# EAGLE design Teensy_FrequencyShield (EAGLE 6.6.0)
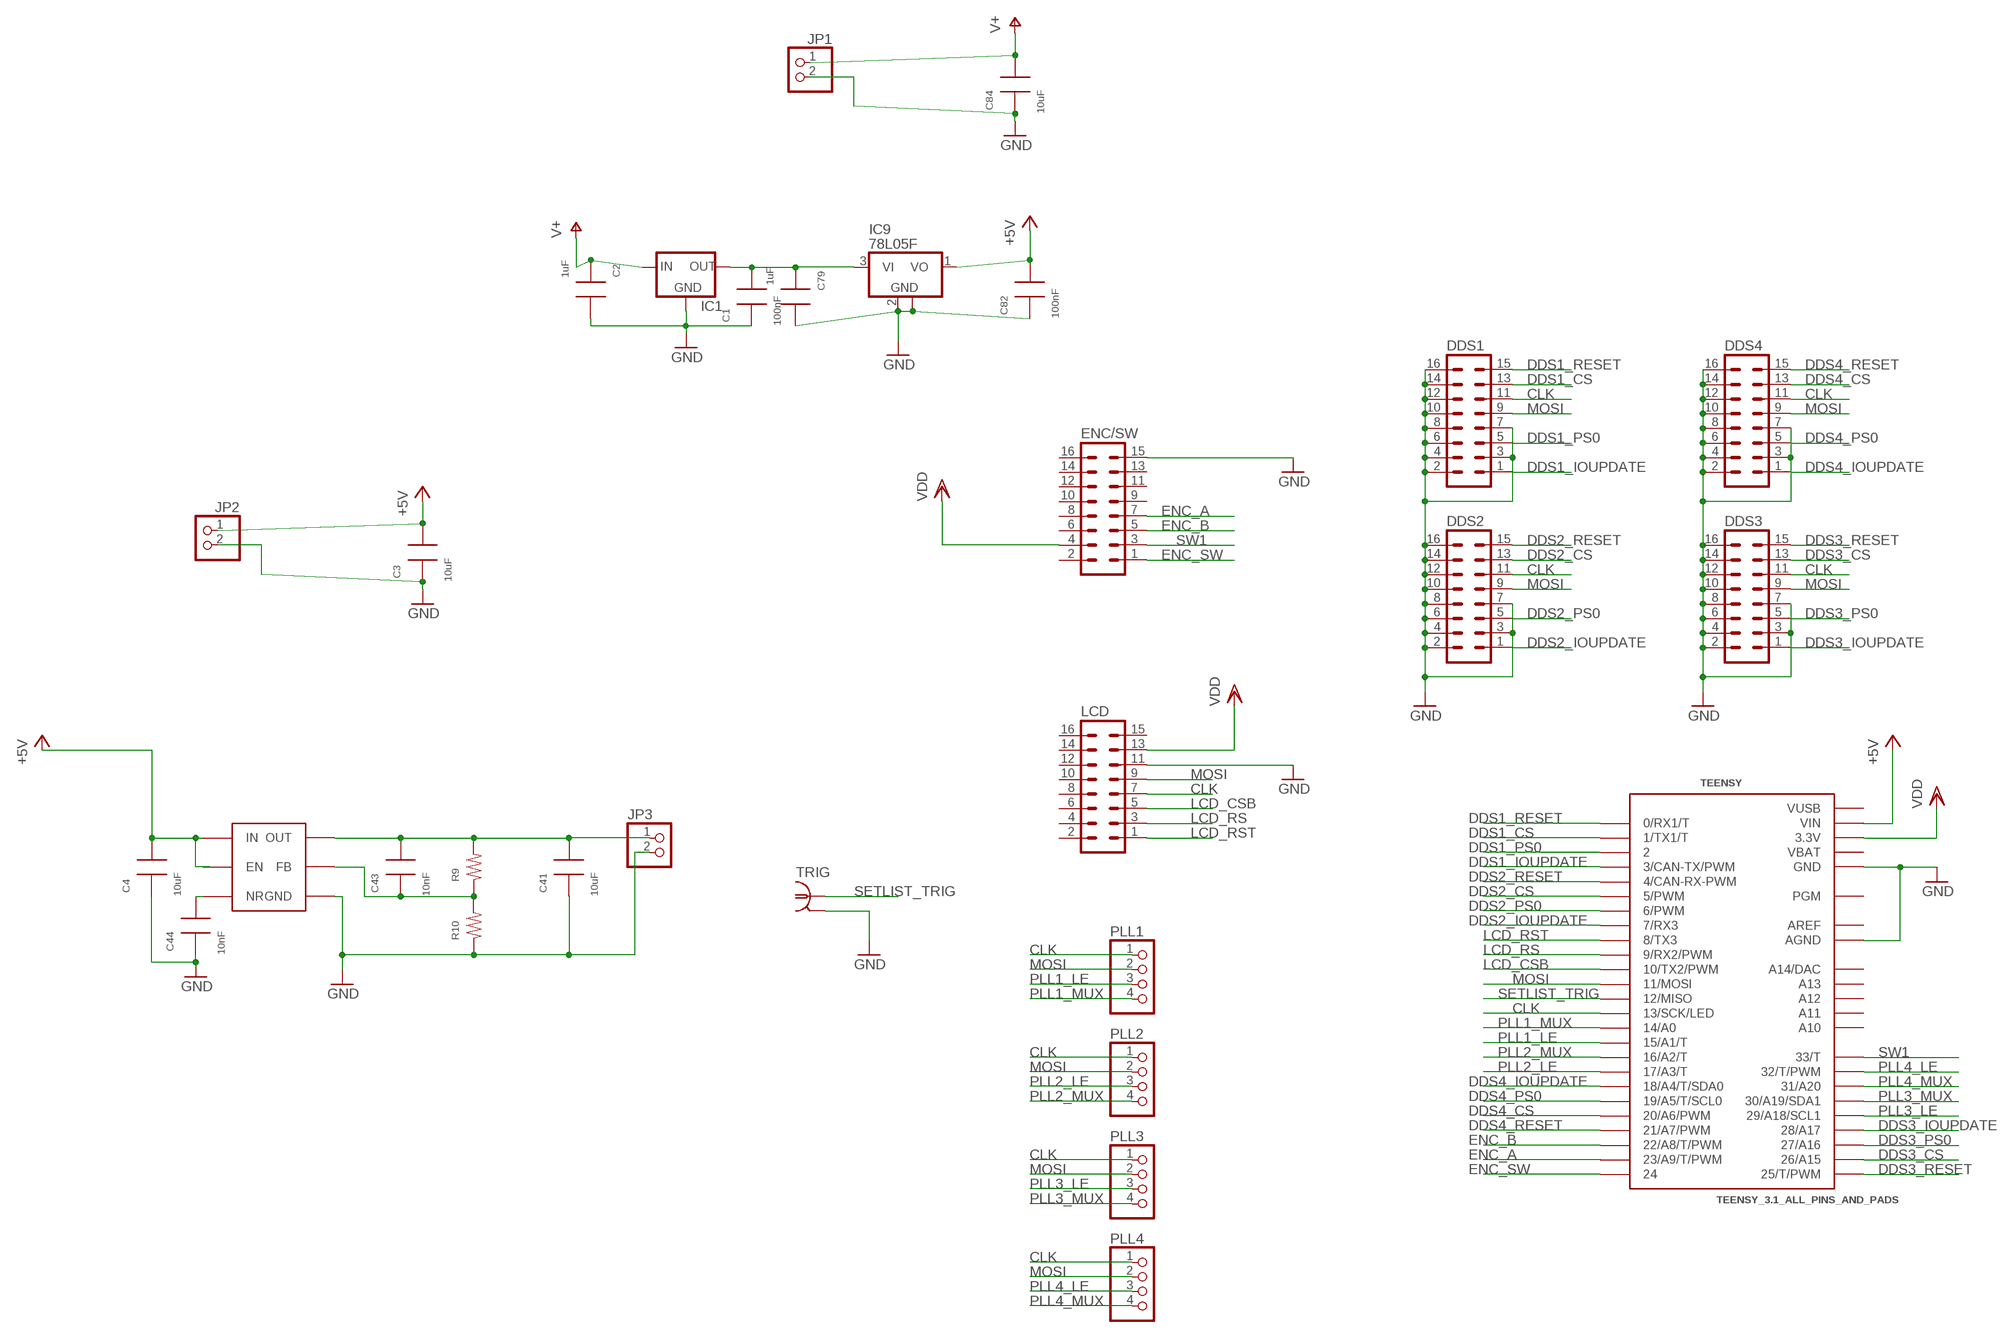
[diagram p0: schematic, sheet 1]

## Parts
C1  100nF  CAP0603  [0603]
C2  1uF  CAP0805  [0805]
C3  10uF  CAP0805  [0805]
C4  10uF  CAP0805  [0805]
C41  10uF  CAP0805  [0805]
C43  10nF  CAP0603  [0603]
C44  10nF  CAP0603  [0603]
C79  1uF  CAP0805  [0805]
C82  100nF  CAP0603  [0603]
C84  10uF  CAP0805  [0805]
DDS1  ML16  [ML16]
DDS2  ML16  [ML16]
DDS3  ML16  [ML16]
DDS4  ML16  [ML16]
ENC/SW  ML16  [ML16]
IC1  78XX-TO220  [TO220]
IC9  78L05F  [SOT89]
JP1  PINHD-1X2  [1X02]
JP2  PINHD-1X2  [1X02]
JP3  PINHD-1X2  [1X02]
LCD  ML16  [ML16]
PLL1  PINHD-1X4  [1X04]
PLL2  PINHD-1X4  [1X04]
PLL3  PINHD-1X4  [1X04]
PLL4  PINHD-1X4  [1X04]
R9  RES0603  [0603]
R10  RES0603  [0603]
TEENSY  TEENSY_3.1_ALL_PINS_AND_PADS  [TEENSY_3.1_ALLPINS]
TRIG  BNC-H  [BNC90]
U4  TPS7A4901  TPS7A49XX  [DGN]

## Nets
+5V: C3.2 C4.2 C82.2 IC9.1(VO) JP2.1 TEENSY.VIN U4.IN
CLK: DDS1.11 DDS2.11 DDS3.11 DDS4.11 LCD.7 PLL1.1 PLL2.1 PLL3.1 PLL4.1 TEENSY.13(13/SCK/LED)
DDS1_CS: DDS1.13 TEENSY.1(1/TX1/T)
DDS1_IOUPDATE: DDS1.1 TEENSY.3(3/CAN-TX/PWM)
DDS1_PS0: DDS1.5 TEENSY.2
DDS1_RESET: DDS1.15 TEENSY.0(0/RX1/T)
DDS2_CS: DDS2.13 TEENSY.5(5/PWM)
DDS2_IOUPDATE: DDS2.1 TEENSY.7(7/RX3)
DDS2_PS0: DDS2.5 TEENSY.6(6/PWM)
DDS2_RESET: DDS2.15 TEENSY.4(4/CAN-RX-PWM)
DDS3_CS: DDS3.13 TEENSY.26(26/A15)
DDS3_IOUPDATE: DDS3.1 TEENSY.28(28/A17)
DDS3_PS0: DDS3.5 TEENSY.27(27/A16)
DDS3_RESET: DDS3.15 TEENSY.25(25/T/PWM)
DDS4_CS: DDS4.13 TEENSY.20/A6(20/A6/PWM)
DDS4_IOUPDATE: DDS4.1 TEENSY.18/A4(18/A4/T/SDA0)
DDS4_PS0: DDS4.5 TEENSY.19/A5(19/A5/T/SCL0)
DDS4_RESET: DDS4.15 TEENSY.21/A7(21/A7/PWM)
ENC_A: ENC/SW.7 TEENSY.23/A9(23/A9/T/PWM)
ENC_B: ENC/SW.5 TEENSY.22/A8(22/A8/T/PWM)
ENC_SW: ENC/SW.1 TEENSY.24
GND: C1.1 C2.2 C3.1 C4.1 C41.1 C44.1 C79.2 C82.1 C84.1 DDS1.2 DDS1.3 DDS1.4 DDS1.6 DDS1.7 DDS1.8 DDS1.10 DDS1.12 DDS1.14 DDS1.16 DDS2.2 DDS2.3 DDS2.4 DDS2.6 DDS2.7 DDS2.8 DDS2.10 DDS2.12 DDS2.14 DDS2.16 DDS3.2 DDS3.3 DDS3.4 DDS3.6 DDS3.7 DDS3.8 DDS3.10 DDS3.12 DDS3.14 DDS3.16 DDS4.2 DDS4.3 DDS4.4 DDS4.6 DDS4.7 DDS4.8 DDS4.10 DDS4.12 DDS4.14 DDS4.16 ENC/SW.15 IC1.2(GND) IC9.2(GND) IC9.2@1(GND) JP1.2 JP2.2 JP3.2 LCD.11 R10.1 TEENSY.AGND TEENSY.GND TEENSY.GND1(GND) TEENSY.GND2(GND) TRIG.2 U4.GND U4.GND1(GND)
LCD_CSB: LCD.5 TEENSY.10(10/TX2/PWM)
LCD_RS: LCD.3 TEENSY.9(9/RX2/PWM)
LCD_RST: LCD.1 TEENSY.8(8/TX3)
MOSI: DDS1.9 DDS2.9 DDS3.9 DDS4.9 LCD.9 PLL1.2 PLL2.2 PLL3.2 PLL4.2 TEENSY.11(11/MOSI)
N$1: C41.2 C43.2 JP3.1 R9.2 U4.OUT
N$2: C1.2 C79.1 IC1.3(OUT) IC9.3(VI)
N$49: C43.1 R9.1 R10.2 U4.FB
N$51: C44.2 U4.NR/SS(NR)
PLL1_LE: PLL1.3 TEENSY.15/A1(15/A1/T)
PLL1_MUX: PLL1.4 TEENSY.14/A0
PLL2_LE: PLL2.3 TEENSY.17/A3(17/A3/T)
PLL2_MUX: PLL2.4 TEENSY.16/A2(16/A2/T)
PLL3_LE: PLL3.3 TEENSY.29(29/A18/SCL1)
PLL3_MUX: PLL3.4 TEENSY.30(30/A19/SDA1)
PLL4_LE: PLL4.3 TEENSY.32(32/T/PWM)
PLL4_MUX: PLL4.4 TEENSY.31(31/A20)
SETLIST_TRIG: TEENSY.12(12/MISO) TRIG.1
SW1: ENC/SW.3 TEENSY.33(33/T)
V+: C2.1 C84.2 IC1.1(IN) JP1.1
VDD: ENC/SW.4 LCD.13 TEENSY.3.3V TEENSY.3.3V1(3.3V) TEENSY.3.3V2(3.3V)
Unconnected: ENC/SW.2 ENC/SW.6 ENC/SW.8 ENC/SW.9 ENC/SW.10 ENC/SW.11 ENC/SW.12 ENC/SW.13 ENC/SW.14 ENC/SW.16 LCD.2 LCD.4 LCD.6 LCD.8 LCD.10 LCD.12 LCD.14 LCD.15 LCD.16 TEENSY.A10 TEENSY.A11 TEENSY.A12 TEENSY.A13 TEENSY.A14(A14/DAC) TEENSY.PGM U4.EN

## Power pins joined to a net without a drawn wire
AREF: TEENSY.AREF
VBAT: TEENSY.VBAT
VUSB: TEENSY.VUSB

## Library data of the parts
C1 C82 = rlc-jqi:CAP: SMT Capacitor; PARTNO: 1276-1936-1-ND
C2 C79 = rlc-jqi:CAP: SMT Capacitor; PARTNO: 1276-2396-1-ND
C3 C4 C41 C84 = rlc-jqi:CAP: SMT Capacitor; PARTNO: 1276-2890-1-ND
C43 C44 = rlc-jqi:CAP: SMT Capacitor; PARTNO: 1276-1921-1-ND
DDS1-DDS4 ENC/SW = mcu-accessories:ML16: HARTING 2x8 (16 pin) ribbon connector.; OC_FARNELL: unknown; OC_NEWARK: unknown
IC1 = regulator-jqi:78XX
IC9 = aom_driver:78L*: POSITOIV-VOLTAGE REGULATORS Output up to 100 mA Source: http://focus.ti.com/lit/ds/symlink/ua78l05.pdf; PARTNO: MC78L05ACHXCT-ND
JP1-JP3 = pinhead:PINHD-1X2: PIN HEADER
LCD = mcu-accessories:ML16: HARTING 2x8 (16 pin) ribbon connector.; OC_FARNELL: unknown; OC_NEWARK: unknown; PARTNO: S9171-ND
PLL1-PLL4 = pinhead:PINHD-1X4: PIN HEADER
R9 = rlc-jqi:RES: SMT Resistor; PARTNO: P9.10KHCT-ND
R10 = rlc-jqi:RES: SMT Resistor; PARTNO: P1.00KHCT-ND
TEENSY = mcu-accessories:TEENSY_3.1_ALL_PINS_AND_PADS: Footprint for Teensy 3.1 board using all pads and all through-holes. Pads need a 2x7 0.1" SMD header.
TRIG = connector-jqi:BNC: BNC Connector.; DIGIKEY: 12345
U4 = aom_driver:TPS7A49XX: TPS7A4901 Adjustable low-noise regulator; PARTNO: 296-27751-1-ND

## Board
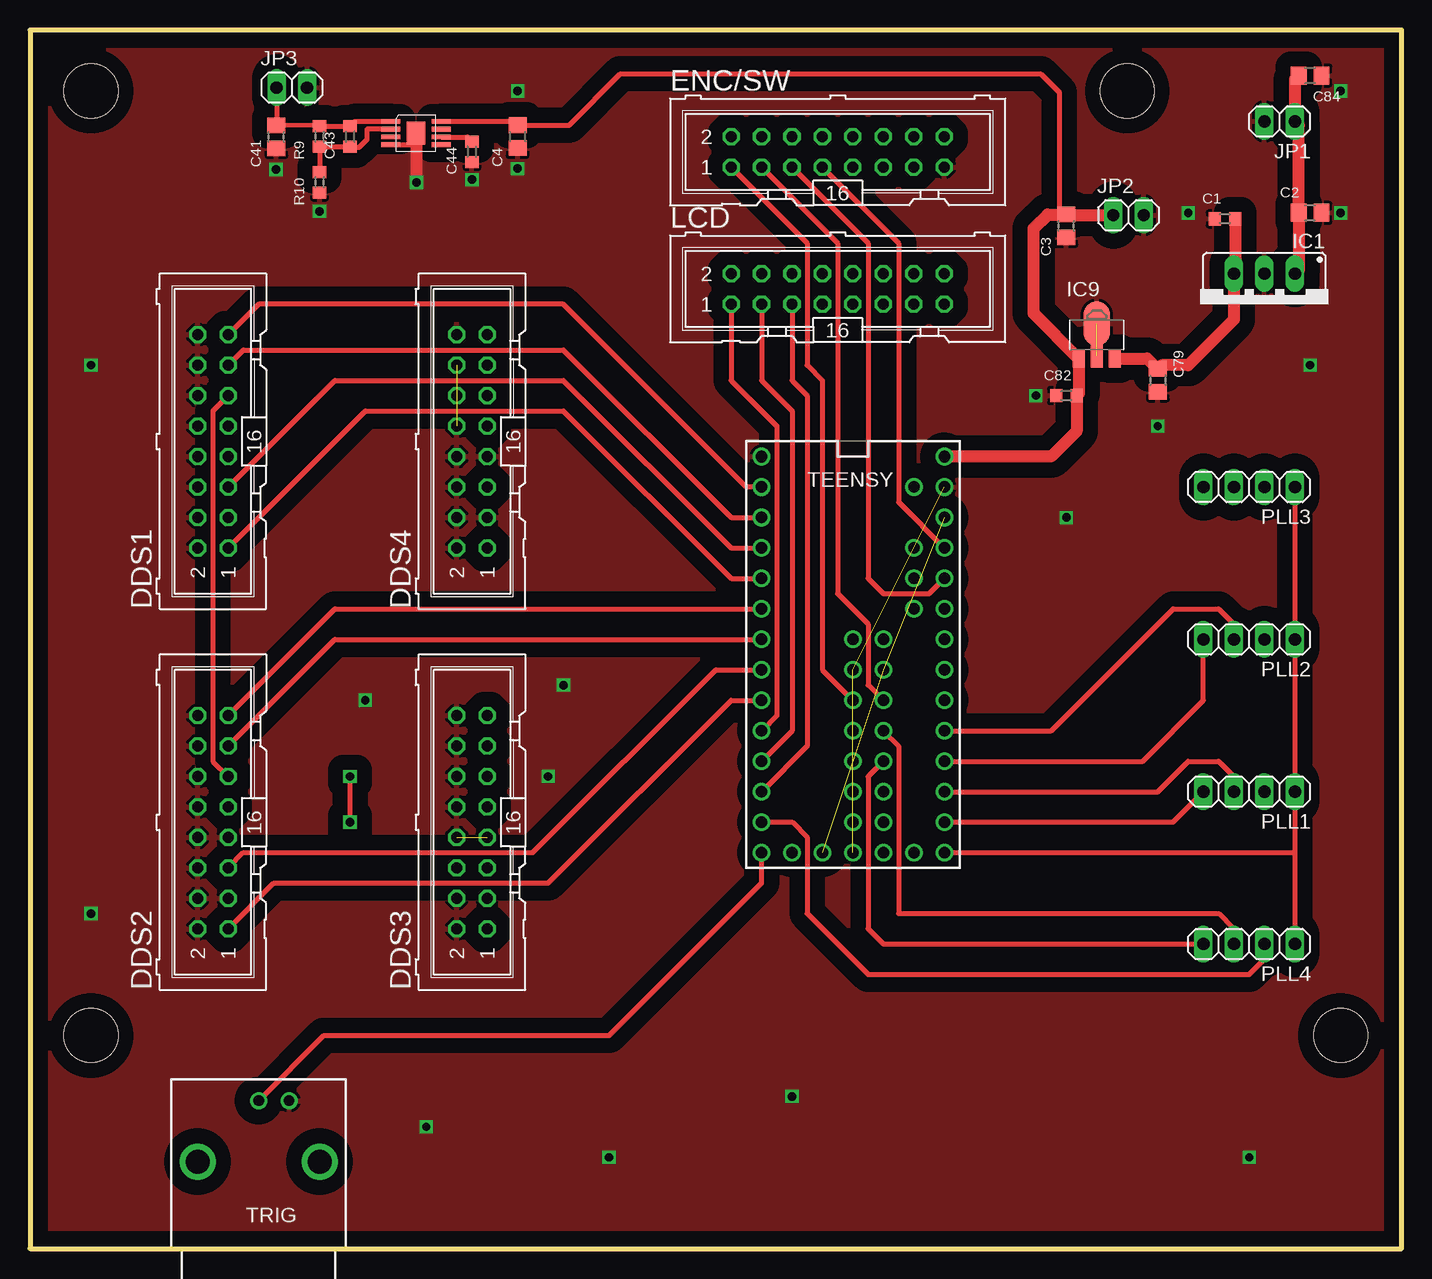
[diagram p1: board, top side]
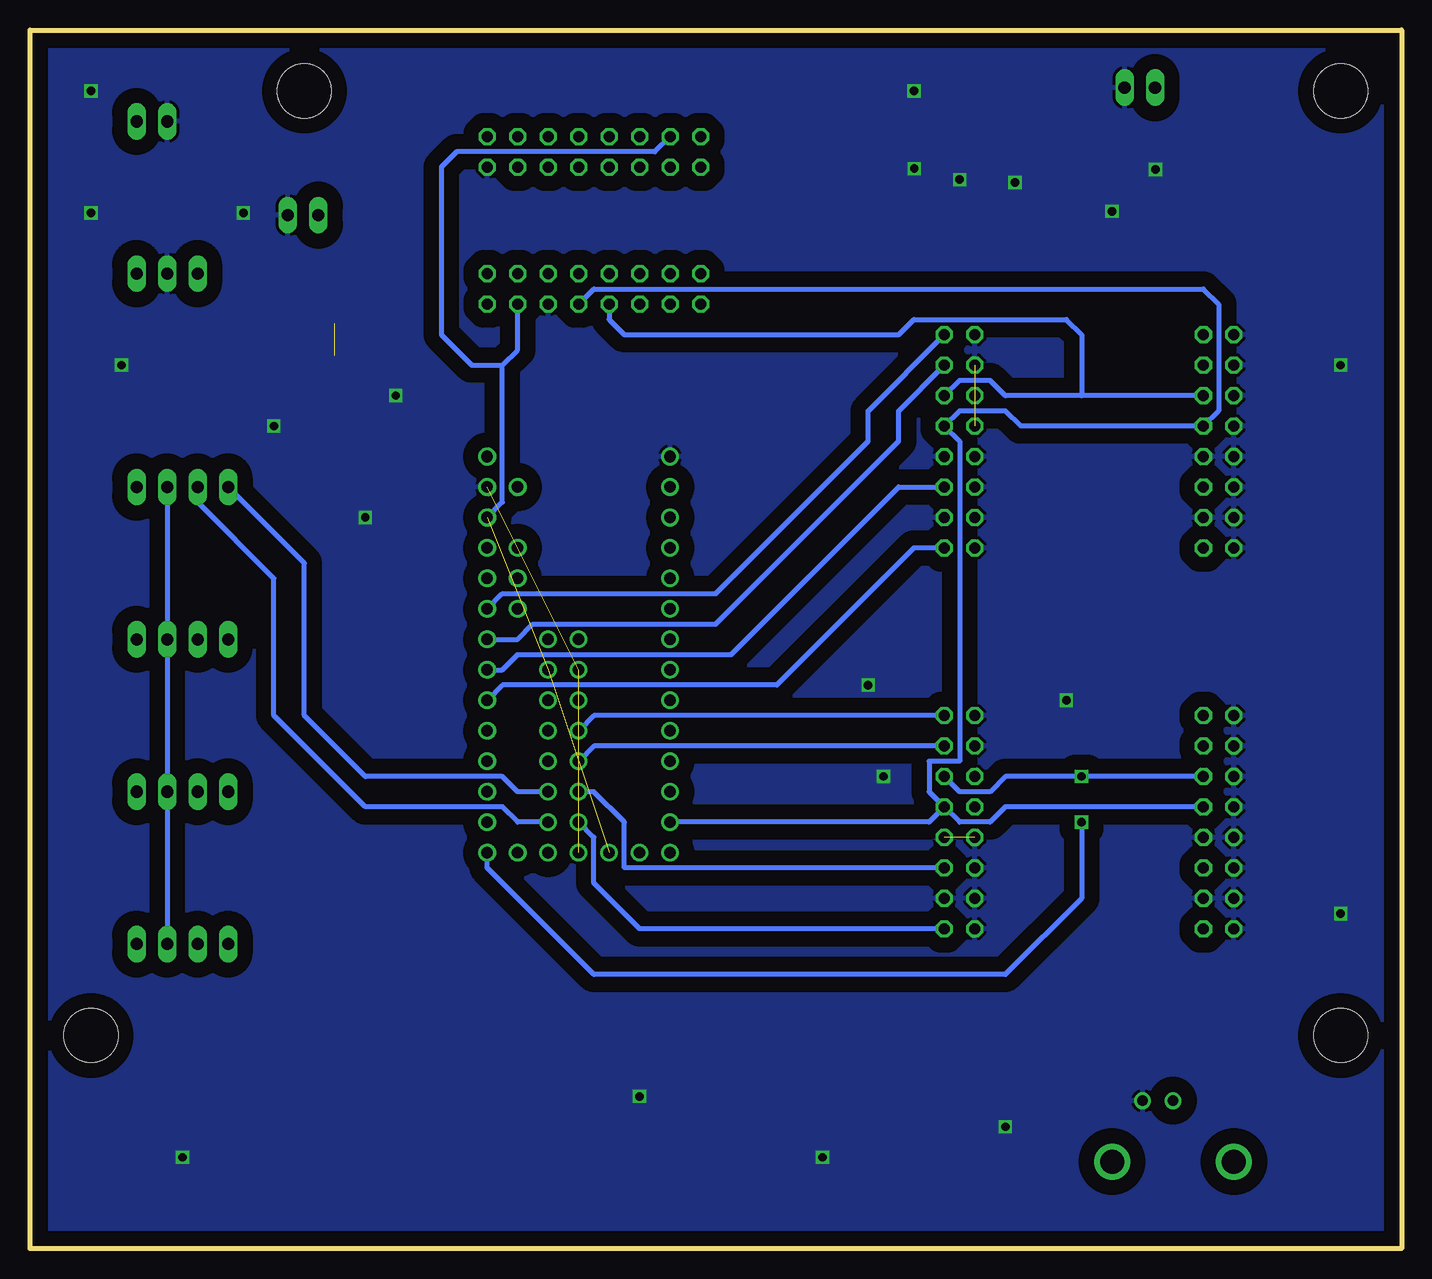
[diagram p2: board, bottom side, seen from below]

Size 114.3 x 101.6 mm. Coordinates in mm from the lower left corner, seen from the top.
Outline: 0,0 114.3,0 114.3,101.6 0,101.6 0,0
Copper layers (1*16): Top 0.035mm / dielectric 1.5mm / Bottom 0.035mm
Design rules "default": minimum track width 10mil, minimum drill 24mil, track to track 8mil, track to pad 8mil, pad to pad 8mil, via to via 8mil, smd to smd 8mil, copper to edge 40mil, drill to drill 8mil, minimum pad ring 10mil, minimum via ring 8mil, stop-mask expansion 4mil, vias tented up to drill 0mil, thermal gap 10mil
Holes 4.5 mm at 5.08,96.52 91.44,96.52 109.22,17.78 5.08,17.78

### Footprints (pad centres in the part's own frame; a part is rotated, then mirrored left to right if it is on the bottom)
0603 = smd 1 x 1.1: 1 -0.85,0; 2 0.85,0
0805 = smd 1.3 x 1.5: 1 -0.95,0; 2 0.95,0
ML16 = drill 0.914 octagon: 1 -8.89,-1.27; 2 -8.89,1.27; 3 -6.35,-1.27; 4 -6.35,1.27; 5 -3.81,-1.27; 6 -3.81,1.27; 7 -1.27,-1.27; 8 -1.27,1.27; 9 1.27,-1.27; 10 1.27,1.27; 11 3.81,-1.27; 12 3.81,1.27; 13 6.35,-1.27; 14 6.35,1.27; 15 8.89,-1.27; 16 8.89,1.27
TO220 = drill 1.016 long: 1 -2.54,0; 2 0,0; 3 2.54,0
SOT89 = smd 1 x 1.5: 1 -1.499,-1.981; 3 1.499,-1.981 | smd 1 x 2: 2 0,-1.727 | smd 2.2 x 3.7: 2@1 0,0.94
1X02 = drill 1.016 long: 1 -1.27,0; 2 1.27,0
1X04 = drill 1.016 long: 1 -3.81,0; 2 -1.27,0; 3 1.27,0; 4 3.81,0
TEENSY_3.1_ALLPINS = drill 0.965: 0 -7.62,15.24; 1 -7.62,12.7; 2 -7.62,10.16; 3 -7.62,7.62; 3.3V 7.62,12.7; 3.3V1 -2.54,-15.24; 3.3V2 2.54,0; 4 -7.62,5.08; 5 -7.62,2.54; 6 -7.62,0; 7 -7.62,-2.54; 8 -7.62,-5.08; 9 -7.62,-7.62; 10 -7.62,-10.16; 11 -7.62,-12.7; 12 -7.62,-15.24; 13 7.62,-15.24; 14/A0 7.62,-12.7; 15/A1 7.62,-10.16; 16/A2 7.62,-7.62; 17/A3 7.62,-5.08; 18/A4 7.62,-2.54; 19/A5 7.62,0; 20/A6 7.62,2.54; 21/A7 7.62,5.08; 22/A8 7.62,7.62; 23/A9 7.62,10.16; 24 0,-2.54; 25 0,-5.08; 26 0,-7.62; 27 0,-10.16; 28 0,-12.7; 29 2.54,-12.7; 30 2.54,-10.16; 31 2.54,-7.62; 32 2.54,-5.08; 33 2.54,-2.54; A10 5.08,7.62; A11 5.08,5.08; A12 0,2.54; A13 2.54,2.54; A14 5.08,-15.24; AGND 7.62,15.24; AREF 5.08,10.16; GND -7.62,17.78; GND1 0,-15.24; GND2 0,0; PGM 2.54,-15.24; VBAT -5.08,-15.24; VIN 7.62,17.78; VUSB 5.08,15.24
BNC90 = drill 0.9 pad 1.27: 1 0,-5.08; 2 -2.54,-5.08 | drill 2 pad 2.032: ANCHOR1 -5.08,0; ANCHOR2 5.08,0
DGN = smd 0.4 x 1.6: DNC 0.65,4.2; EN 1.95,4.2; FB 0.65,0; GND1 1.95,0; IN 0,4.2; NC 1.3,0; NR/SS 1.3,4.2; OUT 0,0 | smd 1.9 x 1.55: GND 0.975,2.1

### Placement (x,y rotation side)
C1  99.57,85.85 0 top
C2  106.68,86.36 0 top
C3  86.36,85.27 90 top
C4  40.64,92.71 90 top
C41  20.52,92.68 90 top
C43  26.67,92.71 90 top
C44  36.83,91.44 90 top
C79  93.98,72.39 270 top
C82  86.36,71.12 0 top
C84  106.68,97.79 180 top
DDS1  15.24,67.31 90 top
DDS2  15.24,35.56 90 top
DDS3  36.83,35.56 90 top
DDS4  36.83,67.31 90 top
ENC/SW  67.31,91.44 0 top
IC1  102.87,81.28 180 top
IC9  88.9,76.2 0 top
JP1  104.14,93.98 180 top
JP2  91.54,86.16 0 top
JP3  21.82,96.8 0 top
LCD  67.31,80.01 0 top
PLL1  101.6,38.1 180 top
PLL2  101.6,50.8 180 top
PLL3  101.6,63.5 180 top
PLL4  101.6,25.4 180 top
R9  24.13,92.71 90 top
R10  24.13,88.9 90 top
TEENSY  68.58,48.26 0 top
TRIG  19.05,7.26 180 top
U4  30.07,93.98 270 top

### Tracks (layer width: path | path; a pad name or v marks a point on that pad's centre or on a via)
+5V
  Top 0.406: U4.IN 40.32,93.98 C4.2 44.92,93.66 49.2,97.94 84.23,97.94 85.75,96.42 85.75,86.22
  Top 1.016: TEENSY.VIN 85.09,66.04 87.21,68.16 C82.2 87.4,71.31 IC9.1 83.64,77.98 83.64,85.06 84.8,86.22 85.75,86.22 C3.2 86.42,86.16 JP2.1
CLK  (via drill 0.7)
  Top 0.406: TEENSY.13 105.41,33.02 PLL1.1 | PLL1.1 PLL4.1 | PLL1.1 PLL2.1 PLL3.1 | v26.67,35.56 v26.67,39.37 | DDS1.11 15.24,69.85 15.24,40.64 DDS2.11
  Bottom 0.406: DDS4.11 36.83,72.39 34.29,72.39 33.02,71.12 26.67,71.12 | DDS2.11 v26.67,39.37 33.02,39.37 34.29,38.1 36.83,38.1 DDS3.11 | LCD.7 66.04,77.47 64.77,76.2 41.91,76.2 40.64,77.47 27.94,77.47 26.67,76.2 26.67,71.12 | DDS1.11 26.67,71.12 | v26.67,35.56 26.67,29.21 33.02,22.86 67.31,22.86 76.2,31.75 TEENSY.13
DDS1_CS
  Top 0.406: DDS1.13 17.78,74.93 44.45,74.93 58.42,60.96 TEENSY.1
DDS1_IOUPDATE
  Top 0.406: DDS1.1 27.94,69.85 44.45,69.85 58.42,55.88 TEENSY.3
DDS1_PS0
  Top 0.406: DDS1.5 25.4,72.39 44.45,72.39 58.42,58.42 TEENSY.2
DDS1_RESET
  Top 0.406: TEENSY.0 59.69,63.5 44.45,78.74 19.05,78.74 DDS1.15
DDS2_CS
  Top 0.406: DDS2.13 25.4,50.8 TEENSY.5
DDS2_IOUPDATE
  Top 0.406: DDS2.1 20.32,30.48 43.18,30.48 58.42,45.72 TEENSY.7
DDS2_PS0
  Top 0.406: DDS2.5 17.78,33.02 41.91,33.02 57.15,48.26 TEENSY.6
DDS2_RESET
  Top 0.406: DDS2.15 25.4,53.34 TEENSY.4
DDS3_CS
  Bottom 0.406: DDS3.13 67.31,41.91 TEENSY.26
DDS3_IOUPDATE
  Bottom 0.406: DDS3.1 63.5,26.67 67.31,30.48 67.31,34.29 TEENSY.28
DDS3_PS0
  Bottom 0.406: DDS3.5 64.77,31.75 64.77,35.56 67.31,38.1 TEENSY.27
DDS3_RESET
  Bottom 0.406: DDS3.15 67.31,44.45 TEENSY.25
DDS4_CS
  Bottom 0.406: TEENSY.20/A6 73.66,50.8 72.39,52.07 57.15,52.07 41.91,67.31 41.91,69.85 DDS4.13
DDS4_IOUPDATE
  Bottom 0.406: DDS4.1 40.64,58.42 52.07,46.99 74.93,46.99 TEENSY.18/A4
DDS4_PS0
  Bottom 0.406: TEENSY.19/A5 74.93,48.26 73.66,49.53 55.88,49.53 41.91,63.5 DDS4.5
DDS4_RESET
  Bottom 0.406: TEENSY.21/A7 74.93,54.61 57.15,54.61 44.45,67.31 44.45,69.85 DDS4.15
ENC_A
  Top 0.406: ENC/SW.7 72.39,83.82 72.39,62.23 TEENSY.23/A9
ENC_B
  Top 0.406: ENC/SW.5 69.85,83.82 69.85,55.88 71.12,54.61 74.93,54.61 TEENSY.22/A8
ENC_SW
  Top 0.406: ENC/SW.1 64.77,83.82 64.77,73.66 66.04,72.39 66.04,48.26 TEENSY.24
GND  (via drill 0.7)  (6 unrouted)
  Top 0.406: U4.GND1 31.91,92.03 31.98,92.1 31.98,92.81 U4.GND | 32.17,88.93 v32.21,88.9
  Top 1.016: U4.GND 32.17,88.93
  other vias: 44.45,46.99 43.18,39.37 86.36,60.96 106.68,73.66 40.64,96.52 27.94,45.72 63.5,12.7 101.6,7.62 33.02,10.16 5.08,27.94 5.08,73.66 48.26,7.62 93.98,68.58 96.52,86.36 109.22,86.36 109.22,96.52 83.82,71.12 24.13,86.49 36.83,89.13 40.61,90.04 20.5,89.97
  pour Top (isolate 1.27): 0,101.6 114.3,101.6 114.3,0 0,0
  pour Bottom (isolate 1.27): 0,101.6 114.3,101.6 114.3,0 0,0
LCD_CSB
  Top 0.406: LCD.5 63.5,72.39 64.77,71.12 64.77,41.91 TEENSY.10
LCD_RS
  Top 0.406: LCD.3 60.96,72.39 63.5,69.85 63.5,43.18 TEENSY.9
LCD_RST
  Top 0.406: LCD.1 58.42,72.39 62.23,68.58 62.23,44.45 TEENSY.8
MOSI
  Top 0.406: TEENSY.11 63.5,35.56 64.77,34.29 64.77,27.94 69.85,22.86 101.6,22.86 102.87,24.13 PLL4.2 102.87,26.67
  Bottom 0.406: DDS2.9 33.02,36.83 34.29,35.56 36.83,35.56 DDS3.9 | PLL3.2 PLL2.2 PLL1.2 PLL4.2 | DDS3.9 39.37,35.56 TEENSY.11 | DDS3.9 39.37,38.1 39.37,40.64 36.83,40.64 36.83,67.31 DDS4.9 36.83,69.85 33.02,69.85 31.75,68.58 DDS1.9 15.24,69.85 15.24,78.74 16.51,80.01 67.31,80.01 LCD.9
N$1
  Top 0.406: U4.OUT 27.09,93.98 C43.2 R9.2 24.03,93.66 C41.2 20.55,93.66 JP3.1
N$2
  Top 1.016: C1.2 100.42,81.37 IC1.3 100.33,77.47 96.52,73.66 94.3,73.66 C79.1 93.1,74.22 IC9.3
N$49
  Top 0.406: U4.FB 28.07,93.32 28.07,92.46 27.41,91.8 26.73,91.8 C43.1 R9.1 R10.2
N$51
  Top 0.406: U4.NR/SS 36.44,92.68 C44.2
PLL1_LE
  Top 0.406: TEENSY.15/A1 93.98,38.1 96.52,40.64 99.06,40.64 100.33,39.37 PLL1.3
PLL1_MUX
  Top 0.406: TEENSY.14/A0 95.25,35.56 PLL1.4
PLL2_LE
  Top 0.406: TEENSY.17/A3 85.09,43.18 95.25,53.34 99.06,53.34 100.33,52.07 PLL2.3
PLL2_MUX
  Top 0.406: TEENSY.16/A2 92.71,40.64 97.79,45.72 PLL2.4
PLL3_LE
  Bottom 0.406: TEENSY.29 73.66,35.56 74.93,36.83 86.36,36.83 93.98,44.45 93.98,55.88 100.33,62.23 PLL3.3
PLL3_MUX
  Bottom 0.406: TEENSY.30 73.66,38.1 74.93,39.37 86.36,39.37 91.44,44.45 91.44,57.15 PLL3.4
PLL4_LE
  Top 0.406: TEENSY.32 72.39,41.91 72.39,27.94 99.06,27.94 100.33,26.67 PLL4.3
PLL4_MUX
  Top 0.406: TEENSY.31 69.85,39.37 69.85,26.67 71.12,25.4 PLL4.4
SETLIST_TRIG
  Top 0.406: TRIG.1 24.49,17.78 48.26,17.78 60.96,30.48 TEENSY.12
SW1
  Top 0.406: ENC/SW.3 67.31,83.82 67.31,54.61 69.85,52.07 69.85,46.99 TEENSY.33
V+
  Top 1.016: IC1.1 105.73,81.6 C2.1 105.73,93.66 JP1.1 105.41,97.47 C84.2
VDD  (2 unrouted)
  Bottom 0.406: TEENSY.3.3V 74.93,62.23 74.93,73.66 | 74.93,73.66 73.66,74.93 LCD.13 | ENC/SW.4 62.23,91.44 78.74,91.44 80.01,90.17 80.01,76.2 77.47,73.66 74.93,73.66